# EAGLE design ssr (EAGLE 7.2.0)
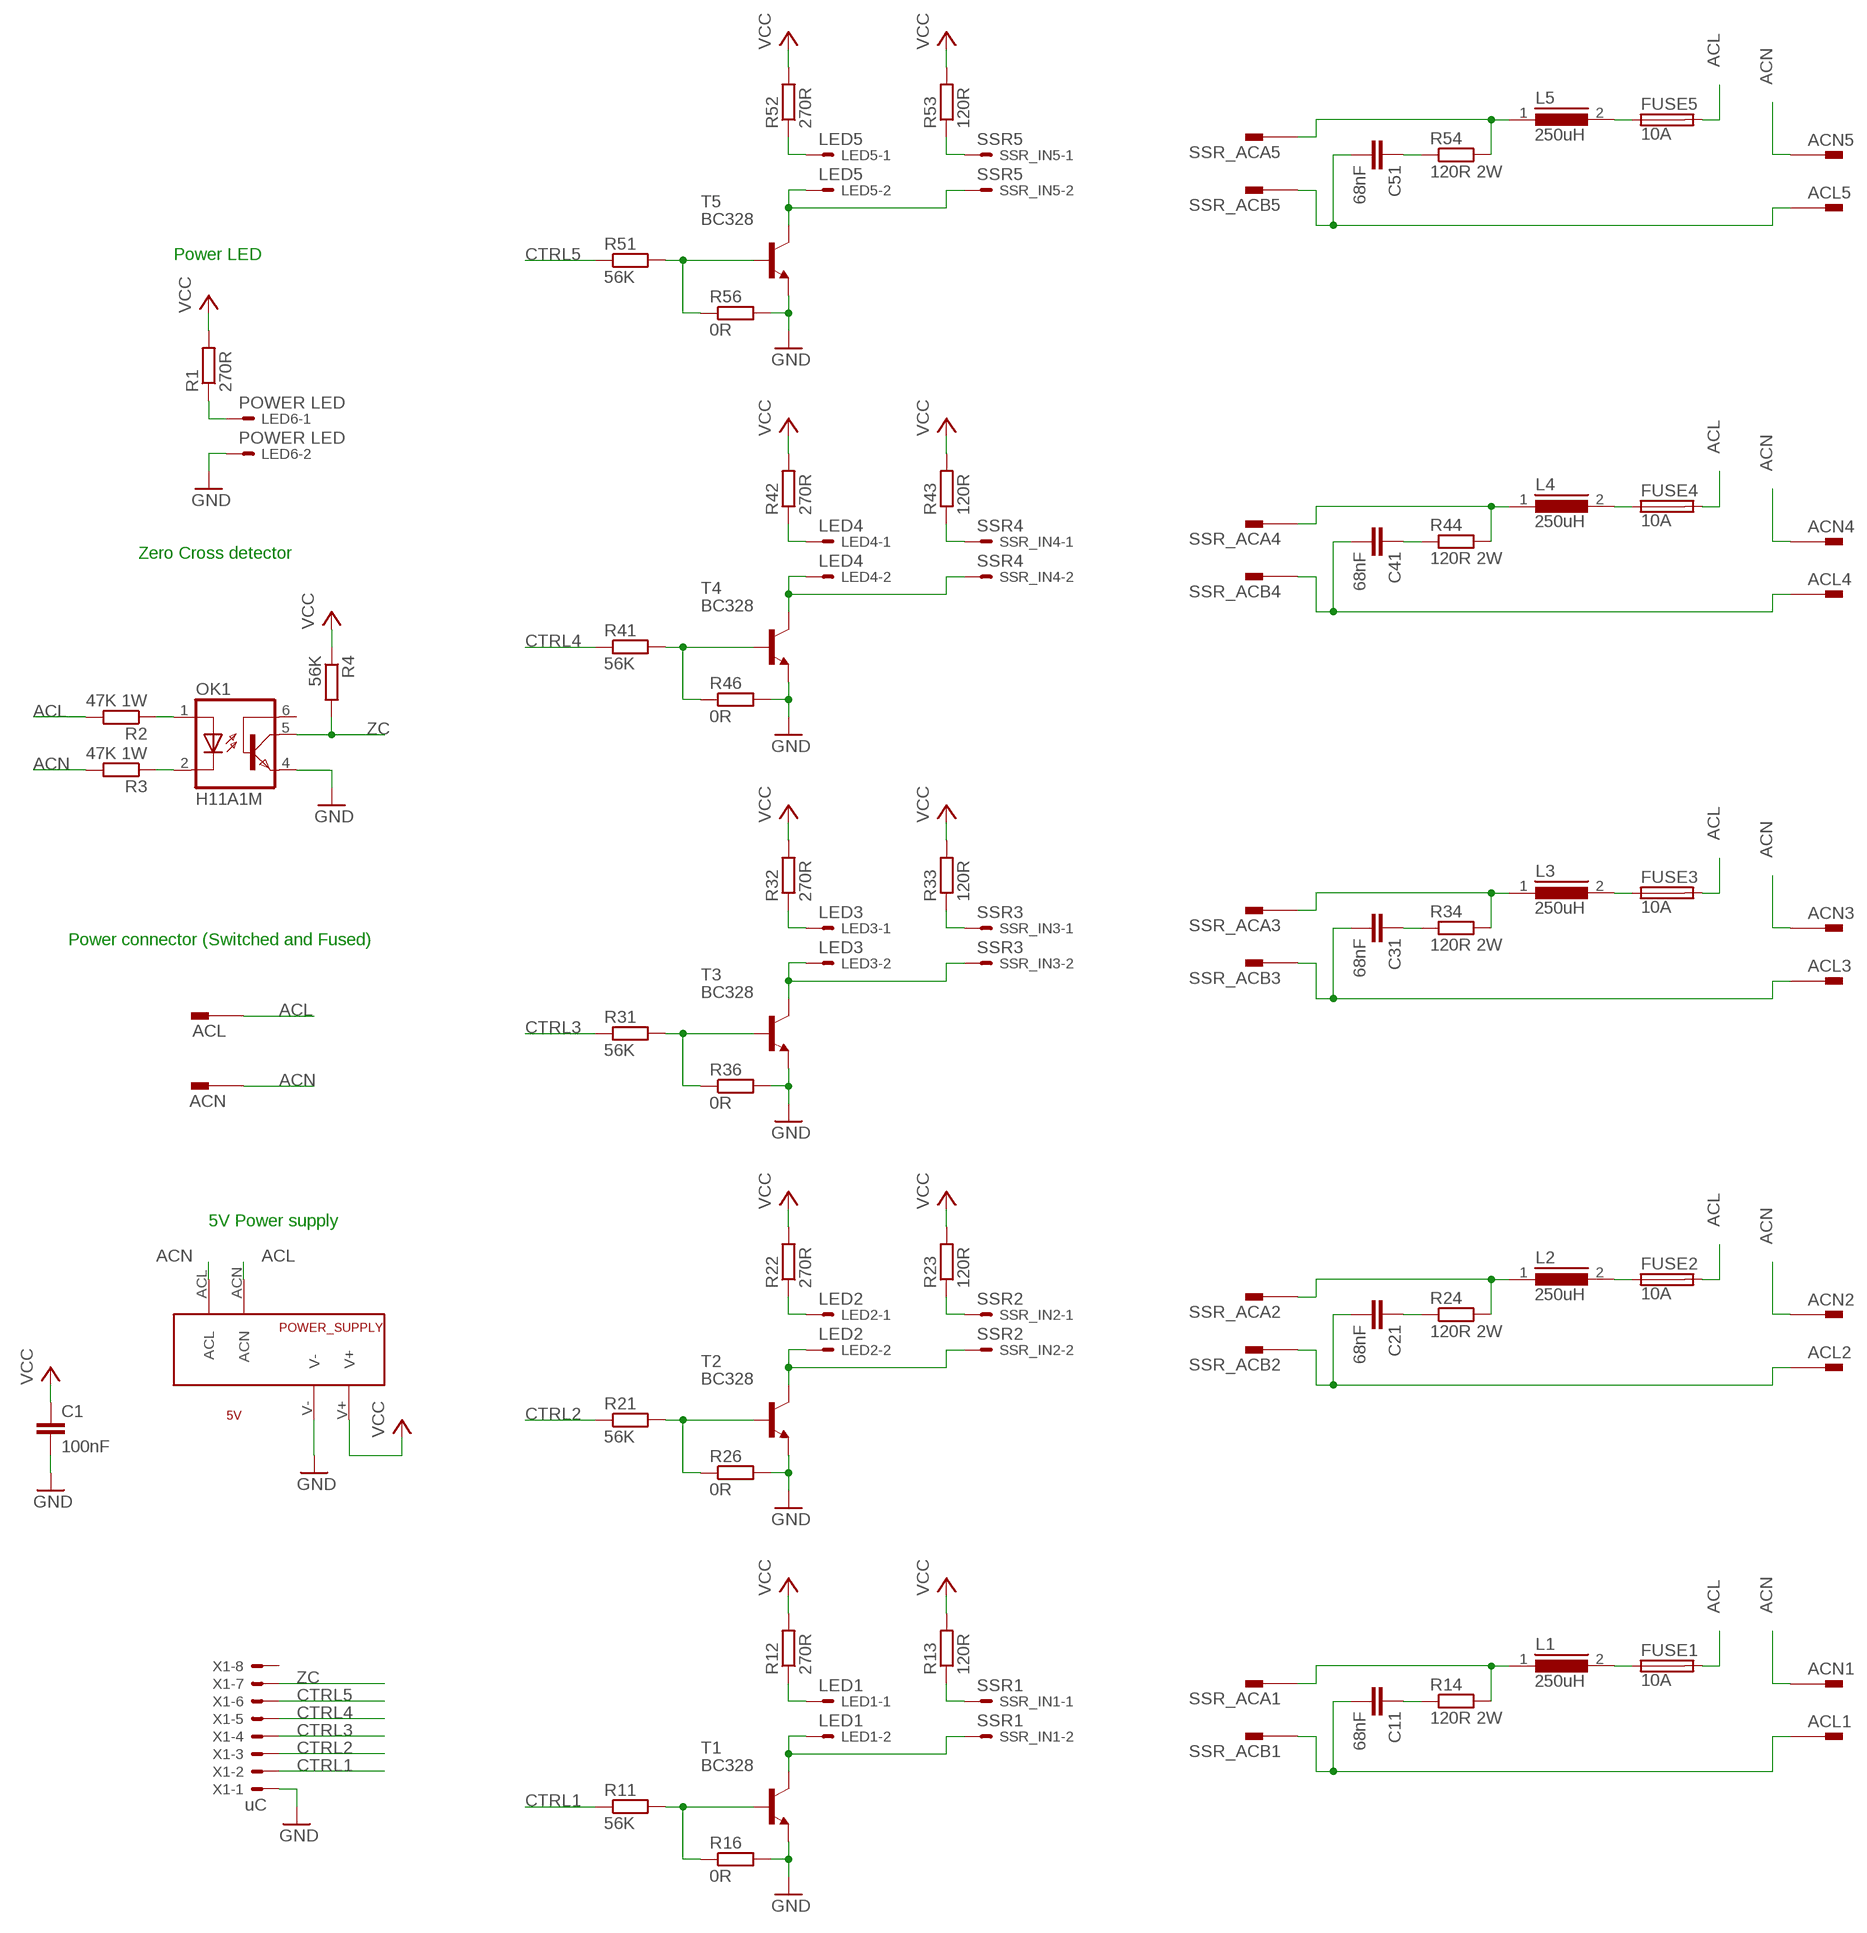
[diagram p0: schematic, sheet 1]

## Parts
ACL  PIN2F061.080  [F061.080]
ACL1  PIN2F061.080  [F061.080]
ACL2  PIN2F061.080  [F061.080]
ACL3  PIN2F061.080  [F061.080]
ACL4  PIN2F061.080  [F061.080]
ACL5  PIN2F061.080  [F061.080]
ACN  PIN2F061.080  [F061.080]
ACN1  PIN2F061.080  [F061.080]
ACN2  PIN2F061.080  [F061.080]
ACN3  PIN2F061.080  [F061.080]
ACN4  PIN2F061.080  [F061.080]
ACN5  PIN2F061.080  [F061.080]
C1  100nF  C2.5/2  [C2.5-2]
C11  68nF  C-EU150-054X183  [C150-054X183]
C21  68nF  C-EU150-054X183  [C150-054X183]
C31  68nF  C-EU150-054X183  [C150-054X183]
C41  68nF  C-EU150-054X183  [C150-054X183]
C51  68nF  C-EU150-054X183  [C150-054X183]
FUSE1  10A  FUSESH22,5  [SH22,5]
FUSE2  10A  FUSESH22,5  [SH22,5]
FUSE3  10A  FUSESH22,5  [SH22,5]
FUSE4  10A  FUSESH22,5  [SH22,5]
FUSE5  10A  FUSESH22,5  [SH22,5]
L1  250uH  ATCA-08  [ATCA-08]
L2  250uH  ATCA-08  [ATCA-08]
L3  250uH  ATCA-08  [ATCA-08]
L4  250uH  ATCA-08  [ATCA-08]
L5  250uH  ATCA-08  [ATCA-08]
LED1  LED1  KK-156-2  [KK-156-2]
LED2  LED2  KK-156-2  [KK-156-2]
LED3  LED3  KK-156-2  [KK-156-2]
LED4  LED4  KK-156-2  [KK-156-2]
LED5  LED5  KK-156-2  [KK-156-2]
LED6  POWER LED  KK-156-2  [KK-156-2]
OK1  H11A1M  [DIL06]
POWER_SUPPLY  5V  SPN00205  [SPN00205]
R1  270R  R-EU_0207/10  [0207/10]
R2  47K 1W  R-EU_0309/12  [0309/12]
R3  47K 1W  R-EU_0309/12  [0309/12]
R4  56K  R-EU_0207/10  [0207/10]
R11  56K  R-EU_0207/10  [0207/10]
R12  270R  R-EU_0207/10  [0207/10]
R13  120R  R-EU_0207/10  [0207/10]
R14  120R 2W  R-EU_0617/22  [0617/22]
R16  0R  R-EU_0207/10  [0207/10]
R21  56K  R-EU_0207/10  [0207/10]
R22  270R  R-EU_0207/10  [0207/10]
R23  120R  R-EU_0207/10  [0207/10]
R24  120R 2W  R-EU_0617/22  [0617/22]
R26  0R  R-EU_0207/10  [0207/10]
R31  56K  R-EU_0207/10  [0207/10]
R32  270R  R-EU_0207/10  [0207/10]
R33  120R  R-EU_0207/10  [0207/10]
R34  120R 2W  R-EU_0617/22  [0617/22]
R36  0R  R-EU_0207/10  [0207/10]
R41  56K  R-EU_0207/10  [0207/10]
R42  270R  R-EU_0207/10  [0207/10]
R43  120R  R-EU_0207/10  [0207/10]
R44  120R 2W  R-EU_0617/22  [0617/22]
R46  0R  R-EU_0207/10  [0207/10]
R51  56K  R-EU_0207/10  [0207/10]
R52  270R  R-EU_0207/10  [0207/10]
R53  120R  R-EU_0207/10  [0207/10]
R54  120R 2W  R-EU_0617/22  [0617/22]
R56  0R  R-EU_0207/10  [0207/10]
SSR_ACA1  PIN2F061.080  [F061.080]
SSR_ACA2  PIN2F061.080  [F061.080]
SSR_ACA3  PIN2F061.080  [F061.080]
SSR_ACA4  PIN2F061.080  [F061.080]
SSR_ACA5  PIN2F061.080  [F061.080]
SSR_ACB1  PIN2F061.080  [F061.080]
SSR_ACB2  PIN2F061.080  [F061.080]
SSR_ACB3  PIN2F061.080  [F061.080]
SSR_ACB4  PIN2F061.080  [F061.080]
SSR_ACB5  PIN2F061.080  [F061.080]
SSR_IN1  SSR1  KK-156-2  [KK-156-2]
SSR_IN2  SSR2  KK-156-2  [KK-156-2]
SSR_IN3  SSR3  KK-156-2  [KK-156-2]
SSR_IN4  SSR4  KK-156-2  [KK-156-2]
SSR_IN5  SSR5  KK-156-2  [KK-156-2]
T1  BC328  [TO92]
T2  BC328  [TO92]
T3  BC328  [TO92]
T4  BC328  [TO92]
T5  BC328  [TO92]
X1  uC  KK-156-8  [KK-156-8]

## Nets
ACL: ACL.1A ACL.1B FUSE1.2 FUSE2.2 FUSE3.2 FUSE4.2 FUSE5.2 POWER_SUPPLY.ACN R2.2
ACN: ACN1.1A ACN1.1B ACN2.1A ACN2.1B ACN3.1A ACN3.1B ACN4.1A ACN4.1B ACN5.1A ACN5.1B ACN.1A ACN.1B POWER_SUPPLY.ACL R3.2
CTRL1: R11.1 X1.2
CTRL2: R21.1 X1.3
CTRL3: R31.1 X1.4
CTRL4: R41.1 X1.5
CTRL5: R51.1 X1.6
GND: C1.2 LED6.2 OK1.4(EMI) POWER_SUPPLY.V- R16.2 R26.2 R36.2 R46.2 R56.2 T1.1(E) T2.1(E) T3.1(E) T4.1(E) T5.1(E) X1.1
N$1: LED1.2 SSR_IN1.2 T1.3(C)
N$2: LED1.1 R12.1
N$3: R13.1 SSR_IN1.1
N$4: R11.2 R16.1 T1.2(B)
N$5: C11.1 R14.1
N$6: OK1.2(C) R3.1
N$7: OK1.1(A) R2.1
N$8: R23.1 SSR_IN2.1
N$9: LED2.1 R22.1
N$10: R21.2 R26.1 T2.2(B)
N$11: C21.1 R24.1
N$12: LED2.2 SSR_IN2.2 T2.3(C)
N$13: R33.1 SSR_IN3.1
N$14: LED3.1 R32.1
N$15: R31.2 R36.1 T3.2(B)
N$16: C31.1 R34.1
N$17: LED3.2 SSR_IN3.2 T3.3(C)
N$18: R43.1 SSR_IN4.1
N$19: LED4.1 R42.1
N$20: R41.2 R46.1 T4.2(B)
N$21: C41.1 R44.1
N$22: LED4.2 SSR_IN4.2 T4.3(C)
N$23: R53.1 SSR_IN5.1
N$24: LED5.1 R52.1
N$25: R51.2 R56.1 T5.2(B)
N$26: C51.1 R54.1
N$27: LED5.2 SSR_IN5.2 T5.3(C)
N$28: LED6.1 R1.1
N$29: FUSE5.1 L5.2
N$30: FUSE4.1 L4.2
N$31: FUSE3.1 L3.2
N$32: FUSE2.1 L2.2
N$33: FUSE1.1 L1.2
SSR_ACA1: L1.1 R14.2 SSR_ACA1.1A SSR_ACA1.1B
SSR_ACA2: L2.1 R24.2 SSR_ACA2.1A SSR_ACA2.1B
SSR_ACA3: L3.1 R34.2 SSR_ACA3.1A SSR_ACA3.1B
SSR_ACA4: L4.1 R44.2 SSR_ACA4.1A SSR_ACA4.1B
SSR_ACA5: L5.1 R54.2 SSR_ACA5.1A SSR_ACA5.1B
SSR_ACB1: ACL1.1A ACL1.1B C11.2 SSR_ACB1.1A SSR_ACB1.1B
SSR_ACB2: ACL2.1A ACL2.1B C21.2 SSR_ACB2.1A SSR_ACB2.1B
SSR_ACB3: ACL3.1A ACL3.1B C31.2 SSR_ACB3.1A SSR_ACB3.1B
SSR_ACB4: ACL4.1A ACL4.1B C41.2 SSR_ACB4.1A SSR_ACB4.1B
SSR_ACB5: ACL5.1A ACL5.1B C51.2 SSR_ACB5.1A SSR_ACB5.1B
VCC: C1.1 POWER_SUPPLY.V+ R1.2 R4.1 R12.2 R13.2 R22.2 R23.2 R32.2 R33.2 R42.2 R43.2 R52.2 R53.2
ZC: OK1.5(COL) R4.2 X1.7
Unconnected: OK1.6(BAS) X1.8

## Notes on the sheet
- Power LED
- Zero Cross detector
- Power connector (Switched and Fused)
- 5V Power supply

## Library data of the parts
ACL ACL1-ACL5 ACN ACN1-ACN5 SSR_ACA1-SSR_ACA5 SSR_ACB1-SSR_ACB5 = parts:PIN2: Flachstecker Typ Tyco/Electronics/AMP TAB, FASTON Printed Circuit Board Tabs Source: http://www.buerklin.com, http://catalog.tycoelectronics.com; OC_FARNELL: unknown; OC_NEWARK: unknown
C1 = capacitor-wima:C: CAPACITOR naming: grid - package width
C11 C21 C31 C41 C51 = resistor:C-EU: CAPACITOR, European symbol
FUSE1-FUSE5 = fuse:FUSE: Fuse; OC_FARNELL: unknown; OC_NEWARK: unknown
L1-L5 = parts:ATCA-08: INDUCTOR
LED1-LED6 SSR_IN1-SSR_IN5 = con-molex:KK-156-2: KK 156 HEADER Source: http://www.molex.com/pdm_docs/sd/026604100_sd.pdf; OC_FARNELL: unknown; OC_NEWARK: unknown
OK1 = optocoupler:H11A*?M: General Purpose 6-Pin Phototransistor Optocouplers Source: http://www.fairchildsemi.com/ds/4N/4N35-M.pdf; MPN: H11A1-M; OC_FARNELL: 1021358; OC_NEWARK: 97K1793
POWER_SUPPLY = parts:SPN00205: SPITZNAGEL POWER SUPPLY SPN00205 2W 5V
R1 R4 R11-R13 R16 R21-R23 R26 R31-R33 R36 R41-R43 R46 R51-R53 R56 = parts:R-EU_: RESISTOR, European symbol
R2 R3 R14 R24 R34 R44 R54 = resistor:R-EU_: RESISTOR, European symbol
T1-T5 = parts:BC328: NPN Transistor
X1 = con-molex:KK-156-8: KK 156 HEADER Source: http://www.molex.com/pdm_docs/sd/026604100_sd.pdf; OC_FARNELL: unknown; OC_NEWARK: unknown

## Board
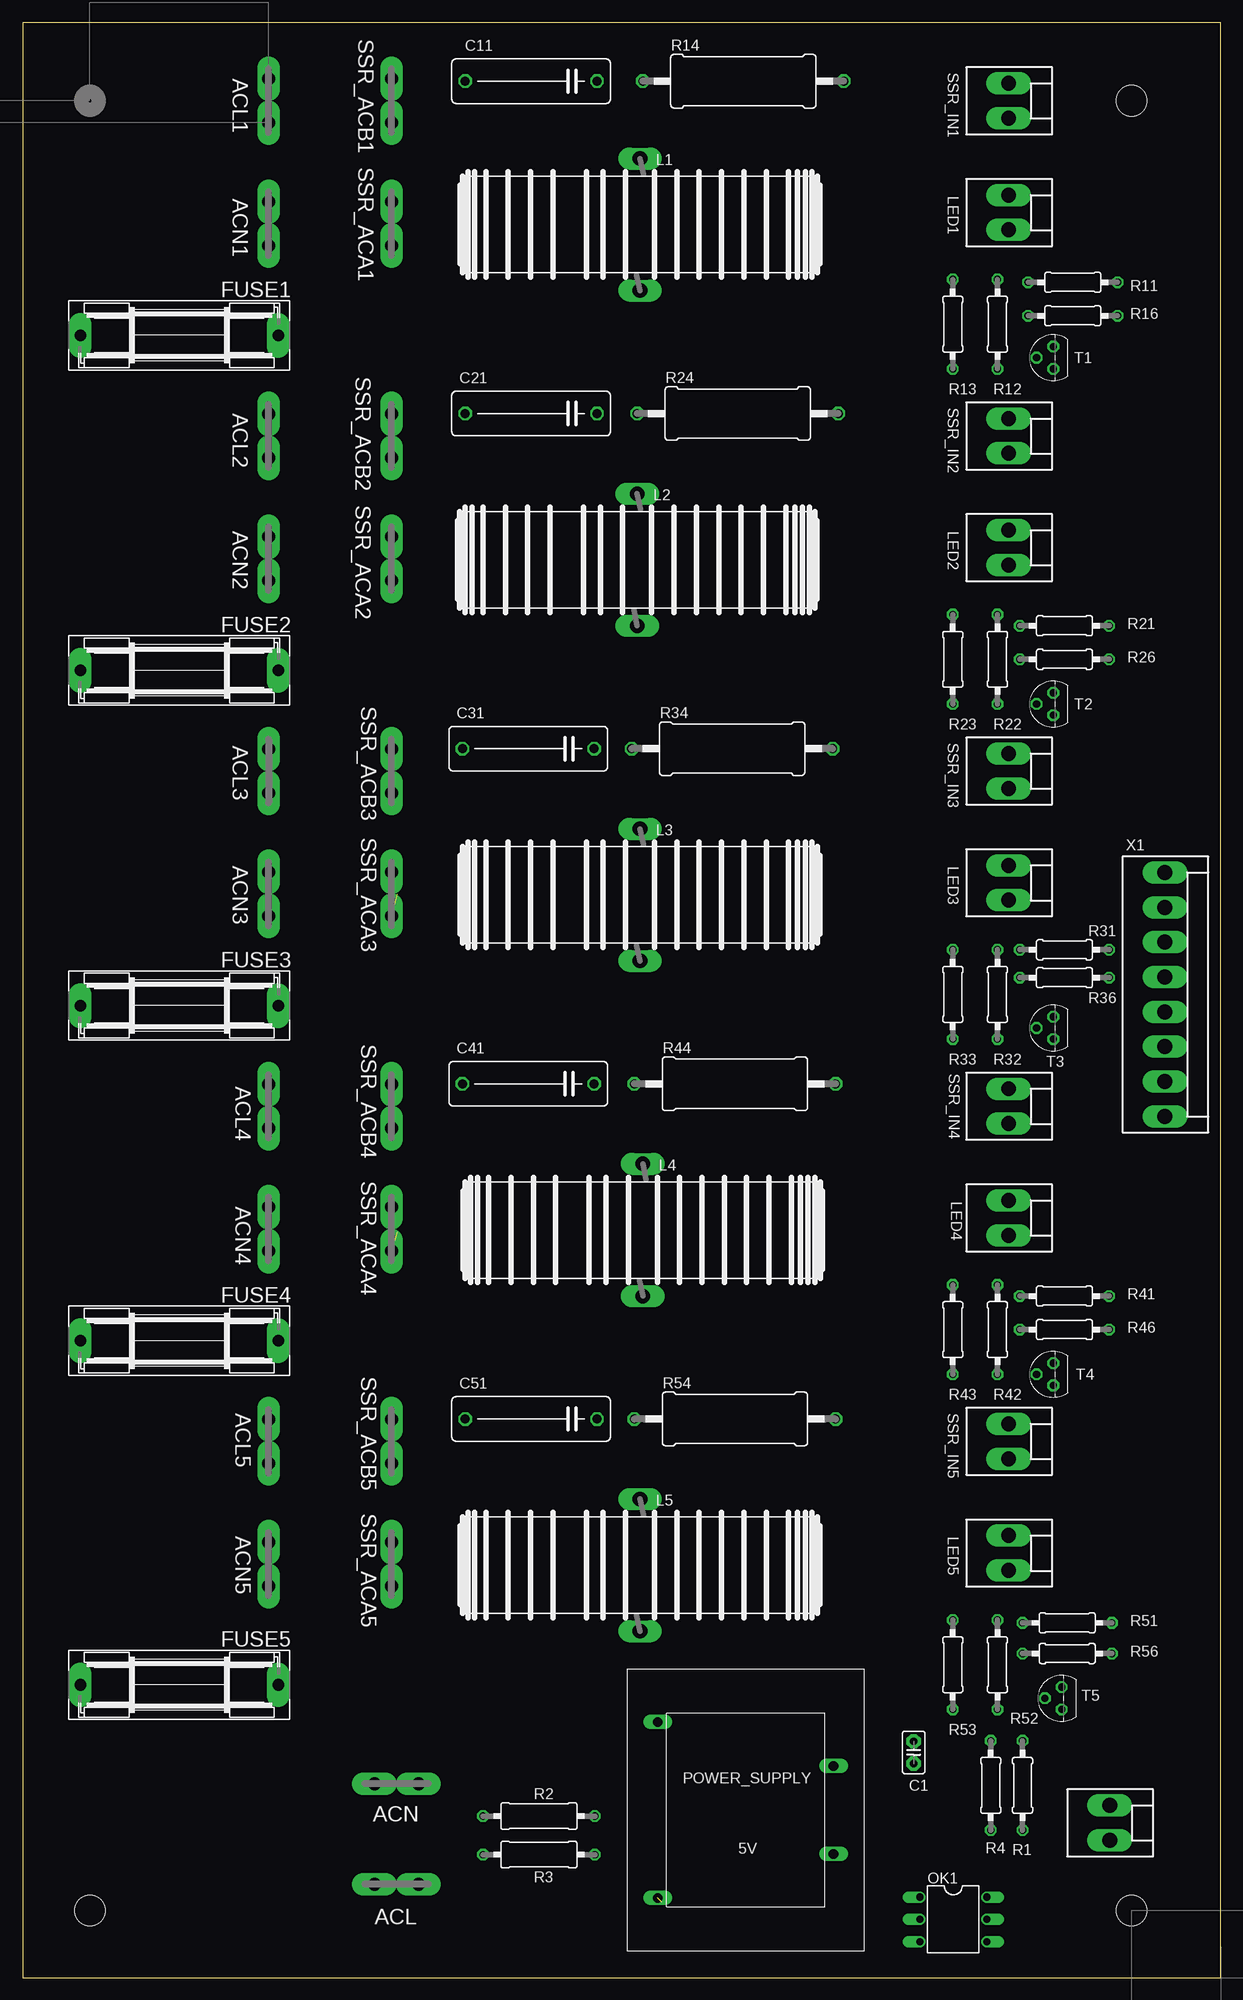
[diagram p1: board, top side]
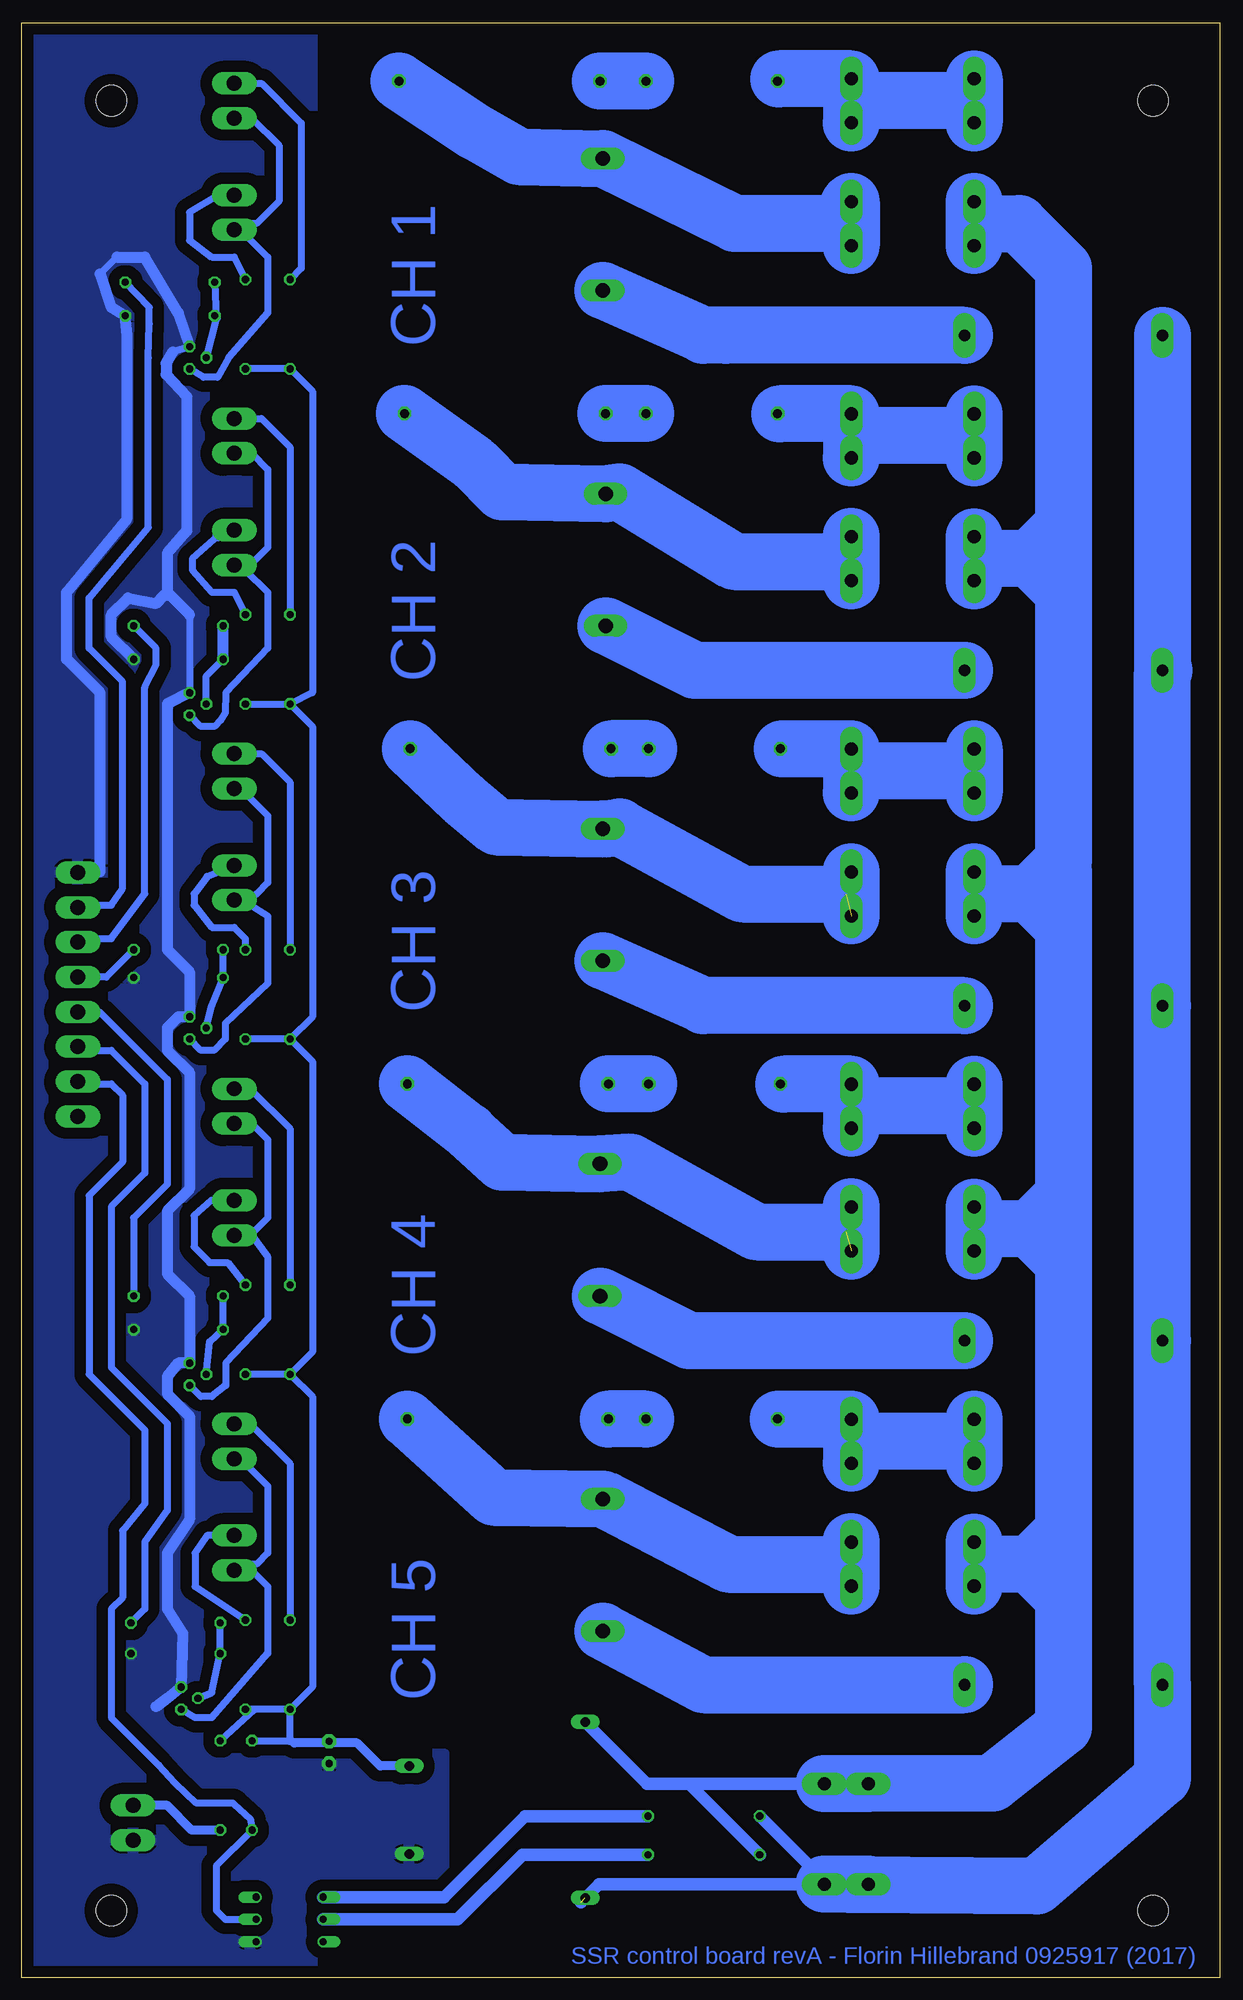
[diagram p2: board, bottom side, seen from below]

Size 136.21 x 222.25 mm. Coordinates in mm from the lower left corner, seen from the top.
Outline: 136.21,222.25 0,222.25 0,0 136.21,0 136.21,222.25
Copper layers (1*16): Top 0.035mm / dielectric 1.5mm / Bottom 0.035mm
Design rules "default *": minimum track width 10mil, minimum drill 10mil, track to track 25mil, track to pad 8mil, pad to pad 8mil, via to via 8mil, smd to smd 8mil, copper to edge 40mil, drill to drill 8mil, minimum pad ring 10mil, minimum via ring 8mil, stop-mask expansion 4mil, vias tented up to drill 0mil, thermal gap 10mil
Holes 3.5 mm at 126.05,7.62 7.62,7.62 126.05,213.36 7.62,213.36

### Footprints (pad centres in the part's own frame; a part is rotated, then mirrored left to right if it is on the bottom)
F061.080 = drill 1.5 pad 2.54 long: 1A -2.5,0; 1B 2.5,0
C2.5-2 = drill 0.813 pad 1.6 octagon: 1 -1.27,0; 2 1.27,0
C150-054X183 = drill 1.016 octagon: 1 -7.493,0; 2 7.493,0
SH22,5 = drill 1.321 pad 2.54 long: 1 -11.252,0; 2 11.252,0
ATCA-08 = drill 1.651 long: 1 -1.05,0; 2 13.97,0
KK-156-2 = drill 1.7 pad 2.184 long: 1 -1.98,0; 2 1.98,0
DIL06 = drill 0.813 offset: 1 -2.54,-3.81; 2 0,-3.81; 3 2.54,-3.81; 4 2.54,3.81; 5 0,3.81; 6 -2.54,3.81
SPN00205 = drill 1.1 long: ACL -10,10; ACN -10,-10; V+ 10,5; V- 10,-5
0207/10 = drill 0.813 octagon: 1 -5.08,0; 2 5.08,0
0309/12 = drill 0.813 octagon: 1 -6.35,0; 2 6.35,0
0617/22 = drill 1.016 octagon: 1 -11.43,0; 2 11.43,0
TO92 = drill 0.813 octagon: 1 1.27,0; 2 0,1.905; 3 -1.27,0
KK-156-8 = drill 1.7 pad 2.184 long: 1 -13.86,0; 2 -9.9,0; 3 -5.94,0; 4 -1.98,0; 5 1.98,0; 6 5.94,0; 7 9.9,0; 8 13.86,0

### Placement (x,y rotation side)
ACL  42.48,10.6 180 top
ACL1  27.94,213.36 90 top
ACL2  27.94,175.26 90 top
ACL3  27.94,137.16 270 top
ACL4  27.94,99.06 90 top
ACL5  27.94,60.96 90 top
ACN  42.48,22.03 180 top
ACN1  27.94,199.39 90 top
ACN2  27.94,161.29 90 top
ACN3  27.94,123.19 90 top
ACN4  27.94,85.09 90 top
ACN5  27.94,46.99 90 top
C1  101.28,25.59 270 top
C11  57.78,215.58 180 top
C21  57.78,177.8 180 top
C31  57.47,139.7 180 top
C41  57.47,101.6 180 top
C51  57.78,63.5 180 top
DRILEGEND  [DRILEGEND]  -0.06,-13.76 0 top  (outside the outline)
FUSE1  17.78,186.69 180 top
FUSE2  17.78,148.59 180 top
FUSE3  17.78,110.49 180 top
FUSE4  17.78,72.39 180 top
FUSE5  17.78,33.27 180 top
L1  70.17,205.74 270 top
L2  69.85,167.64 270 top
L3  70.17,129.54 270 top
L4  70.48,91.44 270 top
L5  70.17,53.34 270 top
LED1  112.08,200.66 270 top
LED2  112.08,162.56 270 top
LED3  112.08,124.46 270 top
LED4  112.08,86.36 270 top
LED5  112.08,48.26 270 top
LED6  123.57,17.59 270 top
OK1  105.79,6.6 270 top
POWER_SUPPLY  82.17,19.05 0 top
R1  113.67,21.84 90 top
R2  58.67,18.35 180 top
R3  58.67,13.97 180 top
R4  110.05,21.84 270 top
R11  119.38,192.72 180 top
R12  110.81,187.96 270 top
R13  105.73,187.96 270 top
R14  81.91,215.58 0 top
R16  119.38,188.91 0 top
R21  118.43,153.67 180 top
R22  110.81,149.86 270 top
R23  105.73,149.86 270 top
R24  81.28,177.8 0 top
R26  118.43,149.86 0 top
R31  118.43,116.84 180 top
R32  110.81,111.76 270 top
R33  105.73,111.76 270 top
R34  80.65,139.7 0 top
R36  118.43,113.66 0 top
R41  118.43,77.47 180 top
R42  110.81,73.66 270 top
R43  105.73,73.66 270 top
R44  80.96,101.6 0 top
R46  118.43,73.66 0 top
R51  118.75,40.32 180 top
R52  110.81,35.56 270 top
R53  105.73,35.56 270 top
R54  80.96,63.5 0 top
R56  118.75,36.83 0 top
SSR_ACA1  41.91,199.39 90 top
SSR_ACA2  41.91,161.29 90 top
SSR_ACA3  41.91,123.19 90 top
SSR_ACA4  41.91,85.09 90 top
SSR_ACA5  41.91,46.99 90 top
SSR_ACB1  41.91,213.36 90 top
SSR_ACB2  41.91,175.26 90 top
SSR_ACB3  41.91,137.16 90 top
SSR_ACB4  41.91,99.06 90 top
SSR_ACB5  41.91,60.96 90 top
SSR_IN1  112.08,213.36 270 top
SSR_IN2  112.08,175.26 270 top
SSR_IN3  112.08,137.16 270 top
SSR_IN4  112.08,99.06 270 top
SSR_IN5  112.08,60.96 270 top
T1  117.16,184.15 90 top
T2  117.16,144.78 90 top
T3  117.16,107.95 90 top
T4  117.16,68.58 90 top
T5  118.11,31.75 90 top
X1  129.86,111.76 270 top

### Tracks (layer width: path | path; a pad name or v marks a point on that pad's centre or on a via)
ACL  (1 unrouted)
  Bottom 1.422: 72.65,8.57 70.61,10.6 ACL.1A 44.98,11.01 R2.2
  Bottom 6.452: FUSE1.2 FUSE2.2 6.35,148.59 6.53,148.41 FUSE3.2 FUSE4.2 FUSE5.2 6.53,22.68 20.83,10.41 42.48,10.6 | 42.48,10.6 ACL.1A | ACL.1B 42.48,10.6
ACN
  Bottom 1.422: ACN.1A 60.39,22.03 | POWER_SUPPLY.ACL 65.15,22.03 60.39,22.03 | 60.39,22.03 R3.2
  Bottom 6.452: 27.94,199.39 ACN1.1B | ACN1.1A 27.94,199.39 | 27.94,199.39 22.86,199.39 17.78,194.31 17.78,165.1 | 17.78,165.1 17.78,157.48 | 17.78,157.48 17.78,127 21.59,123.19 | ACN2.1A 27.94,161.29 | 27.94,161.29 ACN2.1B | ACN3.1A 27.94,123.19 | 27.94,123.19 ACN3.1B | 17.78,119.38 17.78,125.73 20.32,123.19 21.59,123.19 | 17.78,119.38 17.78,88.9 | 17.78,88.9 17.78,81.28 | 17.78,81.28 17.78,50.8 | ACN4.1A 27.94,85.09 | 27.94,85.09 ACN4.1B | 17.78,50.8 17.78,43.18 | 17.78,43.18 17.78,28.45 25.87,22.1 ACN.1B ACN.1A | ACN5.1A 27.94,46.99 | 27.94,46.99 ACN5.1B | 21.59,46.99 17.78,43.18 | 17.78,50.8 21.59,46.99 | 21.59,46.99 27.94,46.99 | 17.78,88.9 21.59,85.09 | 17.78,81.28 21.59,85.09 | 21.59,85.09 27.94,85.09 | 17.78,119.38 21.59,123.19 | 21.59,123.19 27.94,123.19 | 17.78,165.1 21.59,161.29 | 17.78,157.48 21.59,161.29 | 21.59,161.29 27.94,161.29
CTRL1
  Bottom 0.813: 128.33,121.92 126.05,121.92 124.78,123.82 124.78,147.32 128.59,151.13 128.59,156.84 121.86,164.85 121.86,184.15 121.73,187.96 121.73,189.87 R11.1
  Bottom 1.27: X1.2 128.33,121.92
CTRL2
  Bottom 0.813: 128.18,118.11 126.05,118.11 122.24,123.19 122.24,146.69 120.97,149.22 120.97,151.13 R21.1
  Bottom 1.27: X1.3 128.18,118.11
CTRL3
  Bottom 0.813: R31.1 126.61,113.74 X1.4
CTRL4
  Bottom 0.813: 128.84,109.73 127.32,109.73 119.7,102.11 119.7,90.17 123.51,86.36 R41.1
  Bottom 1.27: X1.5 128.84,109.73
CTRL5
  Bottom 0.813: 128.18,105.41 126.05,105.41 122.24,101.6 122.24,91.44 126.05,87.63 126.05,69.34 119.7,62.99 119.7,53.09 122.24,49.53 122.24,41.91 R51.1
  Bottom 1.27: X1.6 128.18,105.41
GND
  Bottom 0.813: T1.1 119.06,184.78 | 117.16,154.94 T2.1 | 125.41,195.58 127.32,193.68
  Bottom 1.27: 119.06,184.78 119.82,183.51 119.82,182.25 117.47,179.7 117.47,164.47 119.7,161.93 119.7,157.48 119.38,157.16 | 119.38,157.16 117.16,154.94 | T2.1 119.7,144.78 119.7,116.84 117.16,114.3 T3.1 118.43,109.22 119.7,107.95 119.7,105.41 117.16,102.87 117.16,89.66 119.7,87.12 119.7,80.01 117.16,77.47 T4.1 118.43,69.85 119.7,68.33 119.7,66.36 117.16,63.82 117.16,52.07 119.7,48.26 119.7,41.91 117.92,39.12 T5.1 119.7,31.75 120.97,30.8 | X1.1 127.32,125.73 127.32,146.05 131.13,149.86 131.13,157.48 124.27,165.86 124.27,186.69 R16.2 126.05,189.87 127.32,193.68 | 125.41,195.58 122.24,195.58 118.43,189.23 T1.1 | R26.2 126.05,152.4 126.05,154.94 124.14,156.84 120.97,156.21 120.01,157.16 119.38,157.16
  pour Bottom (isolate 1.27, rank 6): 103.19,220.98 137.16,220.98 134.94,1.27 88.2,1.27 88.2,25.4 103.19,25.4
N$1
  Bottom 0.813: SSR_IN1.2 110.1,211.38 107,208.28 107,201.93 109.54,199.39 110.1,199.39 LED1.2 110.81,198.12 108.27,195.58 108.27,189.23 112.71,184.15 113.98,181.93 115.57,181.93 T1.3
N$2
  Bottom 0.813: 113.91,202.64 117.16,200.66 117.16,197.49 114.62,195.58 112.08,195.58 R12.1
  Bottom 1.27: LED1.1 113.91,202.64
N$3
  Bottom 0.813: SSR_IN1.1 108.98,215.34 104.46,210.82 104.46,194.31 R13.1
N$4
  Bottom 0.813: R11.2 114.11,188.59 | 114.11,188.59 T1.2 | 114.11,188.59 113.98,188.59 R16.1
N$5
  Bottom 5.08: C11.1 65.4,215.26
  Bottom 6.452: C11.1 R14.1
N$6
  Bottom 1.422: R3.1 79.31,13.97 86.68,6.6 OK1.2
N$7
  Bottom 1.422: R2.1 78.99,18.35 88.2,9.14 OK1.1
N$8
  Bottom 0.813: SSR_IN2.1 108.98,177.24 105.73,173.99 R23.1
N$9
  Bottom 0.813: 113.91,163.91 116.84,161.29 116.84,160.02 114.62,157.48 112.08,157.48 R22.1
  Bottom 1.27: LED2.1 113.91,163.91
N$10
  Bottom 0.813: T2.2 115.25,147.95 R26.1
  Bottom 1.27: R26.1 R21.2
N$11
  Bottom 6.452: C21.1 R24.1
N$12
  Bottom 0.813: T2.3 115.89,142.24 114.3,142.24 113.6,142.94 113.09,143.76 113.03,146.05 108.27,151.13 108.27,157.48 110.81,160.02 108.27,162.56 108.27,171.45 110.1,173.28 SSR_IN2.2
  Bottom 1.27: LED2.2 111.37,160.58 110.81,160.02
N$13
  Bottom 0.813: SSR_IN3.1 108.98,139.14 105.73,135.89 R33.1
N$14
  Bottom 0.813: LED3.1 115.18,125.17 116.65,123.19 116.65,121.92 114.62,119.38 112.08,119.38 110.81,118.11 R32.1
N$15
  Bottom 0.813: T3.2 114.62,110.49 R36.1 R31.2
N$16
  Bottom 5.08: C31.1 65.09,140.02
  Bottom 6.452: C31.1 R34.1
N$17
  Bottom 0.813: 111.37,135.18 108.27,132.08 108.27,124.46 109.54,123.19 111.37,121.92 LED3.2 110.25,121.92 108.27,120.65 108.27,113.03 113.09,108.46 113.09,106.68 114.36,105.41 115.89,105.41 T3.3
  Bottom 1.27: SSR_IN3.2 111.37,135.18
N$18
  Bottom 0.813: 110.25,101.04 105.73,96.52 R43.1
  Bottom 1.27: SSR_IN4.1 110.25,101.04
N$19
  Bottom 0.813: LED4.1 114.67,88.34 116.65,86.61 116.65,83.06 114.87,81.28 112.84,81.28 R42.1
N$20
  Bottom 0.813: T4.2 114.87,72.26 R46.1 R41.2
N$21
  Bottom 5.08: C41.1 65.4,101.6
  Bottom 6.452: C41.1 R44.1
N$22
  Bottom 0.813: 110.1,97.08 108.27,95.25 108.27,86.36 110.17,84.45 108.27,81.91 108.27,74.93 113.03,69.85 113.03,67.31 114.62,66.04 115.89,66.04 T4.3
  Bottom 1.27: SSR_IN4.2 110.1,97.08 | LED4.2 110.88,84.45 110.17,84.45
N$23
  Bottom 0.813: 110.25,62.94 105.73,58.42 R53.1
  Bottom 1.27: SSR_IN5.1 110.25,62.94
N$24
  Bottom 0.813: LED5.1 115.18,50.24 116.52,48.26 116.52,44.45 R52.1
N$25
  Bottom 0.813: T5.2 114.62,32.38 R56.1 R51.2
N$26
  Bottom 5.08: C51.1 65.72,63.18
  Bottom 6.452: C51.1 R54.1
N$27
  Bottom 0.813: 111.37,58.98 108.27,55.88 108.27,48.26 109.54,46.99 111.37,46.99 LED5.2 110.1,46.28 108.27,44.45 108.27,36.83 114.62,29.53 116.52,29.53 T5.3
  Bottom 1.27: SSR_IN5.2 111.37,58.98
N$28
  Bottom 1.016: R1.1 116.9,16.76 119.7,19.56 123.56,19.56 LED6.1
N$29
  Bottom 6.452: L5.2 58.74,33.27 FUSE5.1
N$30
  Bottom 6.452: FUSE4.1 60.33,72.39 L4.2
N$31
  Bottom 6.452: FUSE3.1 58.74,110.49 L3.2
N$32
  Bottom 6.452: FUSE2.1 59.69,148.59 L2.2
N$33
  Bottom 6.452: FUSE1.1 56.2,186.69 58.74,186.69 L1.2
SSR_ACA1
  Bottom 6.452: R14.2 84.77,209.87 79.69,207.01 L1.1 55.15,199.39 42.23,199.39 42.23,201.65 41.95,201.93 SSR_ACA1.1B SSR_ACA1.1A
SSR_ACA2
  Bottom 6.452: SSR_ACA2.1A 41.91,161.29 | 41.91,161.29 SSR_ACA2.1B 41.95,163.83 | R24.2 84.77,172.08 81.6,168.91 L2.1 68.26,168.91 55.25,160.97 42.23,160.97 41.91,161.29
SSR_ACA3  (1 unrouted)
  Bottom 6.452: SSR_ACA3.1A SSR_ACA3.1B 41.95,125.73 | R34.2 86.04,133.98 82.23,130.81 L3.1 68.26,130.81 54.29,123.19 42.54,123.19
SSR_ACA4  (1 unrouted)
  Bottom 6.452: SSR_ACA4.1A SSR_ACA4.1B 41.95,87.63 | R44.2 85.41,96.2 81.6,92.71 L4.1 66.99,92.71 52.7,84.77 42.54,84.77
SSR_ACA5
  Bottom 6.452: SSR_ACA5.1A 41.91,46.99 | 41.91,46.99 SSR_ACA5.1B 41.95,49.53 | R54.2 82.55,54.61 L5.1 55.88,46.99 41.91,46.99
SSR_ACB1
  Bottom 5.08: 50.17,215.86 C11.2
  Bottom 6.452: 27.94,213.36 ACL1.1A | ACL1.1B 27.94,213.36 | 27.94,213.36 41.91,213.36 | 41.91,213.36 SSR_ACB1.1B 50.17,215.86 | 41.91,213.36 SSR_ACB1.1A
SSR_ACB2
  Bottom 5.08: 50.08,177.76 C21.2
  Bottom 6.452: 27.94,175.26 ACL2.1B | ACL2.1A 27.94,175.26 | 27.94,175.26 41.91,175.26 | 41.91,175.26 SSR_ACB2.1B 50.08,177.76 | 41.91,175.26 SSR_ACB2.1A
SSR_ACB3
  Bottom 5.08: 49.76,139.66 C31.2
  Bottom 6.452: 27.94,137.16 ACL3.1B | ACL3.1A 27.94,137.16 | 27.94,137.16 41.91,137.16 | 41.91,137.16 SSR_ACB3.1B 49.76,139.66 | 41.91,137.16 SSR_ACB3.1A
SSR_ACB4
  Bottom 5.08: 49.62,101.56 C41.2
  Bottom 6.452: 27.94,99.06 ACL4.1B | ACL4.1A 27.94,99.06 | 27.94,99.06 41.91,99.06 | 41.91,99.06 SSR_ACB4.1B 49.62,101.56 | 41.91,99.06 SSR_ACB4.1A
SSR_ACB5
  Bottom 5.08: 50.25,63.46 C51.2
  Bottom 6.452: 27.94,60.96 ACL5.1B | ACL5.1A 27.94,60.96 | 27.94,60.96 41.91,60.96 | 41.91,60.96 SSR_ACB5.1B 50.25,63.46 | 41.91,60.96 SSR_ACB5.1A
VCC
  Bottom 0.813: R12.2 R13.2 103.19,180.34 103.19,146.05 R23.2 | R33.2 R32.2 | R22.2 R23.2 | R23.2 103.19,142.24 103.19,109.22 R33.2 | R33.2 103.19,104.14 103.19,71.12 R43.2 | R43.2 103.19,66.04 103.19,33.02 R53.2 | R43.2 R42.2 | R53.2 R52.2 109.79,30.42 R1.2 | R4.1 105.73,26.92 R53.2 | 98.11,26.67 101.09,26.67 C1.1
  Bottom 1.016: POWER_SUPPLY.V+ 95.49,24.05 98.11,26.67 105.22,26.67 105.73,26.92
ZC
  Bottom 0.813: 128.33,101.6 126.05,101.6 124.78,100.33 124.78,92.71 128.59,88.9 128.59,68.58 122.24,62.23 122.24,53.85 124.78,50.8 124.78,43.18 126.05,41.91 126.05,29.53 120.65,24.13 118.81,22.1 116.4,19.81 112.2,19.81 112.08,19.68 110.17,17.91 R4.2 114.11,12.7 114.11,7.62 113.09,6.6 OK1.5
  Bottom 1.27: X1.7 128.33,101.6

### Text on the board
Bottom: CH 1 | CH 2 | CH 3 | CH 4 | CH 5 | SSR control board revA - Florin Hillebrand 0925917 (2017)
Document: SSR OUT 1 | AC1 | SSR OUT 2 | AC2 | SSR OUT 3 | AC3 | SSR OUT 4 | AC4 | SSR OUT 5 | AC5
tDocu: CH1 | CH2 | CH3 | CH4 | CH5 | MAX 3600W / total load / / MAX 2300W / resistive load / / MAX 1500W / inductive load
DrillLegend: LAYER-STACK
DrillLegend_01-16: 01-16
DrillLegend_01-20: 01-20